# Altium schematic sheet untitled.SchDoc
size 297 x 209 mm
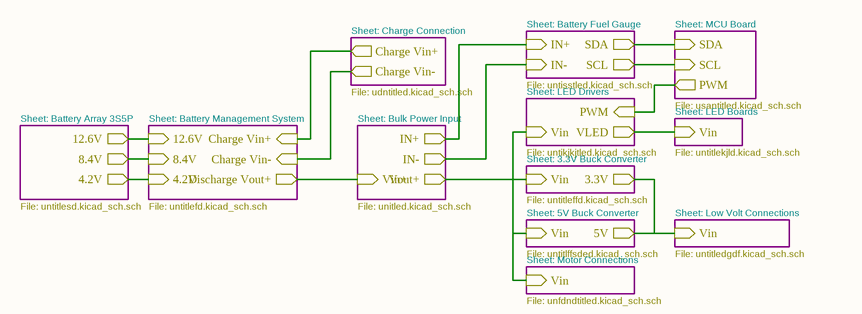
[diagram p0: untitled.SchDoc]

## Sub-sheets
3.3V Buck Converter = untitleffd.SchDoc: Vin (in), 3.3V (out)
5V Buck Converter = untitlffsded.SchDoc: Vin (in), 5V (out)
Battery Array 3S5P = untitlesd.SchDoc: 12.6V (out), 8.4V (out), 4.2V (out)
Battery Fuel Gauge = untisstled.SchDoc: IN+ (in), IN- (in), SCL (out), SDA (out)
Battery Management System = untitlefd.SchDoc: 12.6V (in), 4.2V (in), 8.4V (in), Charge Vin- (in), Charge Vin+ (in), Discharge Vout+ (out)
Bulk Power Input = unitled.SchDoc: IN+ (out), IN- (out), Vout+ (out), Vin+ (in)
Charge Connection = udntitled.SchDoc: Charge Vin+ (out), Charge Vin- (out)
LED Boards = untitlekjld.SchDoc: Vin (in)
LED Drivers = untikjkjtled.SchDoc: Vin (in), VLED (out), PWM (in)
Low Volt Connections = untitledgdf.SchDoc: Vin (in)
MCU Board = usantitled.SchDoc: SDA (in), SCL (in), PWM (out)
Motor Connections = unfdndtitled.SchDoc: Vin (in)

## Nets
(unnamed): sheet MCU Board/SDA, sheet Battery Fuel Gauge/SDA
(unnamed): sheet MCU Board/SCL, sheet Battery Fuel Gauge/SCL
(unnamed): sheet MCU Board/PWM, sheet LED Drivers/PWM
(unnamed): sheet Battery Fuel Gauge/IN+, sheet Bulk Power Input/IN+
(unnamed): sheet Battery Fuel Gauge/IN-, sheet Bulk Power Input/IN-
(unnamed): sheet 5V Buck Converter/Vin, sheet Motor Connections/Vin, sheet LED Drivers/Vin, sheet 3.3V Buck Converter/Vin, sheet Bulk Power Input/Vout+
(unnamed): sheet 5V Buck Converter/5V, sheet Low Volt Connections/Vin, sheet 3.3V Buck Converter/3.3V
(unnamed): sheet Charge Connection/Charge Vin+, sheet Battery Management System/Charge Vin+
(unnamed): sheet Charge Connection/Charge Vin-, sheet Battery Management System/Charge Vin-
(unnamed): sheet Battery Array 3S5P/12.6V, sheet Battery Management System/12.6V
(unnamed): sheet Battery Array 3S5P/8.4V, sheet Battery Management System/8.4V
(unnamed): sheet Battery Array 3S5P/4.2V, sheet Battery Management System/4.2V
(unnamed): sheet LED Boards/Vin, sheet LED Drivers/VLED
(unnamed): sheet Battery Management System/Discharge Vout+, sheet Bulk Power Input/Vin+

## Notes on the sheet
- Sheet: Charge Connection
- Sheet: Battery Fuel Gauge
- Sheet: MCU Board
- Sheet: Battery Array 3S5P
- Sheet: Battery Management System
- File: udntitled.kicad_sch.sch
- Sheet: Bulk Power Input
- File: untisstled.kicad_sch.sch
- Sheet: LED Drivers
- File: usantitled.kicad_sch.sch
- Sheet: LED Boards
- File: untikjkjtled.kicad_sch.sch
- File: untitleffd.kicad_sch.sch
- Sheet: 3.3V Buck Converter
- File: untitlekjld.kicad_sch.sch
- File: untitlesd.kicad_sch.sch
- File: untitlefd.kicad_sch.sch
- File: unitled.kicad_sch.sch
- File: untitlffsded.kicad_sch.sch
- Sheet: 5V Buck Converter
- Sheet: Motor Connections
- File: untitledgdf.kicad_sch.sch
- Sheet: Low Volt Connections
- File: unfdndtitled.kicad_sch.sch
- 1
- 2
- 3
- 4
- 5
- 6
- A
- B
- C
- D
- Title:
- File: untitled.kicad_sch
- Sheet: /
- KiCad E.D.A.  kicad (5.1.4)-1
- Size: A4
- Date:
- Rev:
- Id: 1/1